# EAGLE design backplane (EAGLE 8.0.1)
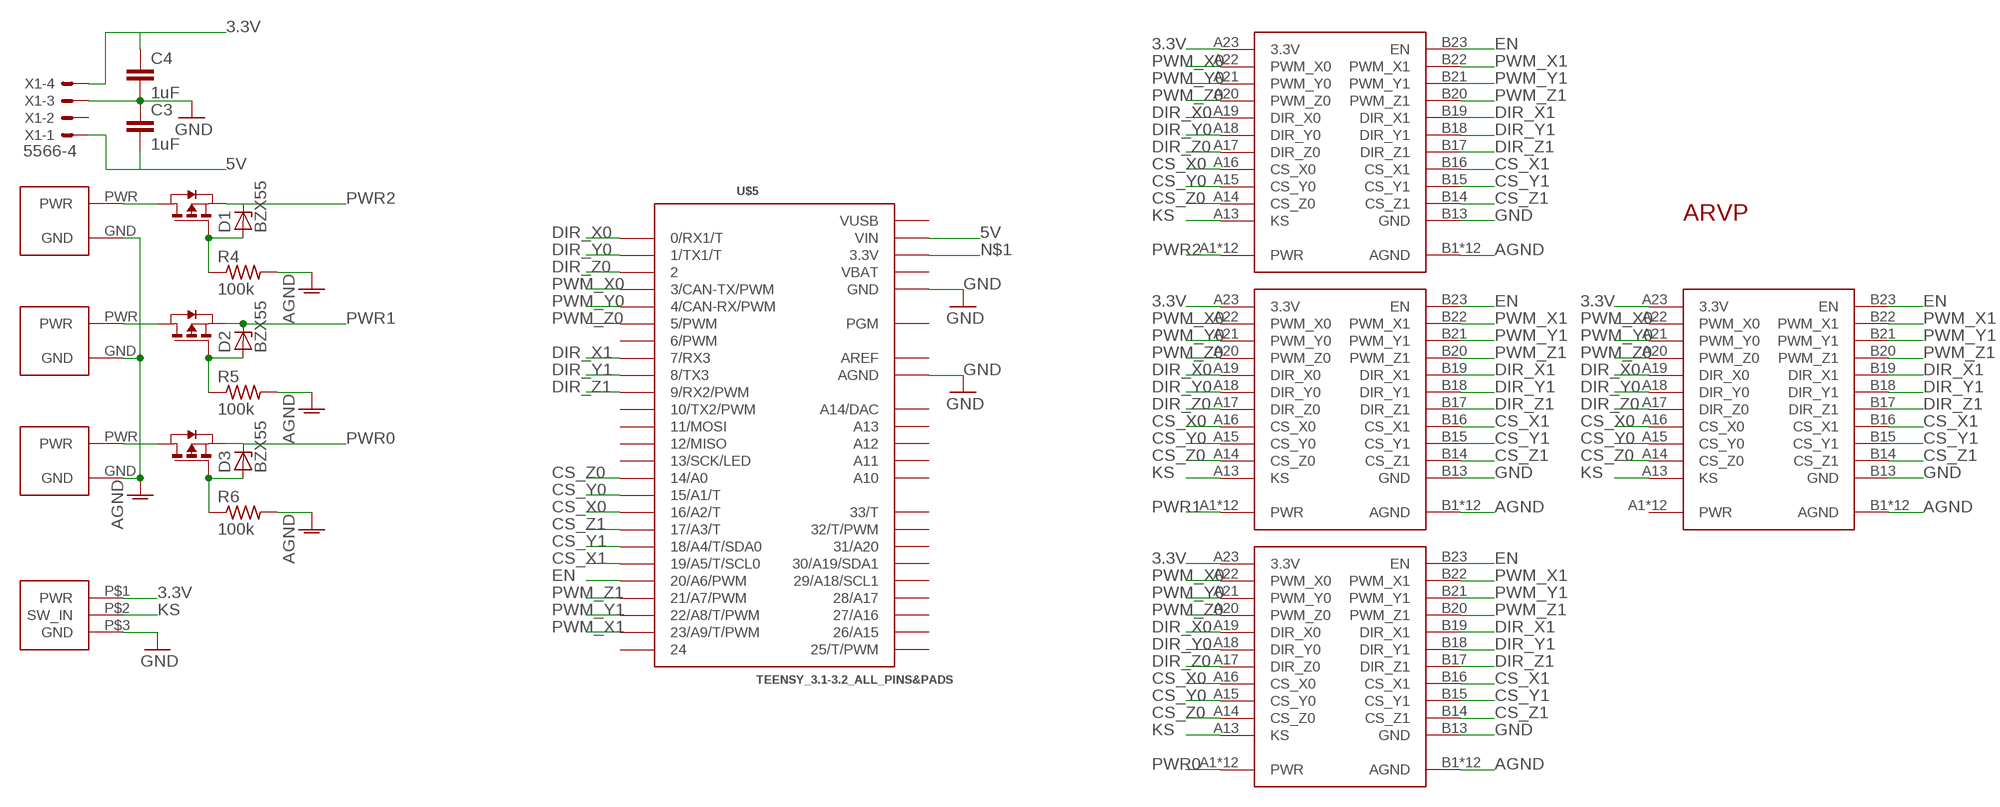
[diagram p0: schematic, sheet 1]

## Parts
C3  1uF  C5/2.5  [C5B2.5]
C4  1uF  C5/2.5  [C5B2.5]
D1  BZX55  [DO35Z10]
D2  BZX55  [DO35Z10]
D3  BZX55  [DO35Z10]
R4  100k  R-US_0309/12  [0309/12]
R5  100k  R-US_0309/12  [0309/12]
R6  100k  R-US_0309/12  [0309/12]
U$1  AND_PWR  [AND_PWR]
U$2  AND_PWR  [AND_PWR]
U$3  AND_PWR  [AND_PWR]
U$4  CONN_50PIN  [CONN_50PIN]
U$5  TEENSY_3.1-3.2_ALL_PINS&PADS  [TEENSY_3.0-3.2_ALL_PINS_&_PADS]
U$6  IPB180P04P4L-02  [PG-TO263-7-3]
U$7  IPB180P04P4L-02  [PG-TO263-7-3]
U$8  IPB180P04P4L-02  [PG-TO263-7-3]
U$9  CONN_50PIN  [CONN_50PIN]
U$10  CONN_50PIN  [CONN_50PIN]
U$11  CONN_50PIN  [CONN_50PIN]
U$12  KILL_SW  [KILL_SW]
U$13  ARVP_LOGO  [ARVP]
X1  5566-4  [5566-4]

## Nets
3.3V: C4.1 U$4.A23(3.3V) U$9.A23(3.3V) U$10.A23(3.3V) U$11.A23(3.3V) U$12.P$1(PWR) X1.4
5V: C3.2 U$5.VIN X1.1
AGND: R4.2 R5.2 R6.2 U$1.GND U$2.GND U$3.GND U$4.B1(AGND) U$4.B2(AGND) U$4.B3(AGND) U$4.B4(AGND) U$4.B5(AGND) U$4.B6(AGND) U$4.B7(AGND) U$4.B8(AGND) U$4.B9(AGND) U$4.B10(AGND) U$4.B11(AGND) U$4.B12(AGND) U$9.B1(AGND) U$9.B2(AGND) U$9.B3(AGND) U$9.B4(AGND) U$9.B5(AGND) U$9.B6(AGND) U$9.B7(AGND) U$9.B8(AGND) U$9.B9(AGND) U$9.B10(AGND) U$9.B11(AGND) U$9.B12(AGND) U$10.B1(AGND) U$10.B2(AGND) U$10.B3(AGND) U$10.B4(AGND) U$10.B5(AGND) U$10.B6(AGND) U$10.B7(AGND) U$10.B8(AGND) U$10.B9(AGND) U$10.B10(AGND) U$10.B11(AGND) U$10.B12(AGND) U$11.B1(AGND) U$11.B2(AGND) U$11.B3(AGND) U$11.B4(AGND) U$11.B5(AGND) U$11.B6(AGND) U$11.B7(AGND) U$11.B8(AGND) U$11.B9(AGND) U$11.B10(AGND) U$11.B11(AGND) U$11.B12(AGND)
BAT+0: U$3.PWR U$8.8(D)
BAT+1: U$2.PWR U$6.8(D)
BAT+2: U$1.PWR U$7.8(D)
CS_X0: U$4.A16(CS_X0) U$5.16/A2(16/A2/T) U$9.A16(CS_X0) U$10.A16(CS_X0) U$11.A16(CS_X0)
CS_X1: U$4.B16(CS_X1) U$5.19/A5(19/A5/T/SCL0) U$9.B16(CS_X1) U$10.B16(CS_X1) U$11.B16(CS_X1)
CS_Y0: U$4.A15(CS_Y0) U$5.15/A1(15/A1/T) U$9.A15(CS_Y0) U$10.A15(CS_Y0) U$11.A15(CS_Y0)
CS_Y1: U$4.B15(CS_Y1) U$5.18/A4(18/A4/T/SDA0) U$9.B15(CS_Y1) U$10.B15(CS_Y1) U$11.B15(CS_Y1)
CS_Z0: U$4.A14(CS_Z0) U$5.14/A0 U$9.A14(CS_Z0) U$10.A14(CS_Z0) U$11.A14(CS_Z0)
CS_Z1: U$4.B14(CS_Z1) U$5.17/A3(17/A3/T) U$9.B14(CS_Z1) U$10.B14(CS_Z1) U$11.B14(CS_Z1)
DIR_X0: U$4.A19(DIR_X0) U$5.0(0/RX1/T) U$9.A19(DIR_X0) U$10.A19(DIR_X0) U$11.A19(DIR_X0)
DIR_X1: U$4.B19(DIR_X1) U$5.7(7/RX3) U$9.B19(DIR_X1) U$10.B19(DIR_X1) U$11.B19(DIR_X1)
DIR_Y0: U$4.A18(DIR_Y0) U$5.1(1/TX1/T) U$9.A18(DIR_Y0) U$10.A18(DIR_Y0) U$11.A18(DIR_Y0)
DIR_Y1: U$4.B18(DIR_Y1) U$5.8(8/TX3) U$9.B18(DIR_Y1) U$10.B18(DIR_Y1) U$11.B18(DIR_Y1)
DIR_Z0: U$4.A17(DIR_Z0) U$5.2 U$9.A17(DIR_Z0) U$10.A17(DIR_Z0) U$11.A17(DIR_Z0)
DIR_Z1: U$4.B17(DIR_Z1) U$5.9(9/RX2/PWM) U$9.B17(DIR_Z1) U$10.B17(DIR_Z1) U$11.B17(DIR_Z1)
EN: U$4.B23(EN) U$5.20/A6(20/A6/PWM) U$9.B23(EN) U$10.B23(EN) U$11.B23(EN)
GND: C3.1 C4.2 U$4.B13(GND) U$5.AGND U$5.GND U$5.GND1(GND) U$5.GND2(GND) U$9.B13(GND) U$10.B13(GND) U$11.B13(GND) U$12.P$3(GND) X1.3
KS: U$4.A13(KS) U$9.A13(KS) U$10.A13(KS) U$11.A13(KS) U$12.P$2(SW_IN)
N$1: U$5.3.3V U$5.3.3V1(3.3V) U$5.3.3V2(3.3V)
N$5: D3.A R6.1 U$8.1(G)
N$6: D2.A R5.1 U$6.1(G)
N$7: D1.A R4.1 U$7.1(G)
PWM_X0: U$4.A22(PWM_X0) U$5.3(3/CAN-TX/PWM) U$9.A22(PWM_X0) U$10.A22(PWM_X0) U$11.A22(PWM_X0)
PWM_X1: U$4.B22(PWM_X1) U$5.23/A9(23/A9/T/PWM) U$9.B22(PWM_X1) U$10.B22(PWM_X1) U$11.B22(PWM_X1)
PWM_Y0: U$4.A21(PWM_Y0) U$5.4(4/CAN-RX/PWM) U$9.A21(PWM_Y0) U$10.A21(PWM_Y0) U$11.A21(PWM_Y0)
PWM_Y1: U$4.B21(PWM_Y1) U$5.22/A8(22/A8/T/PWM) U$9.B21(PWM_Y1) U$10.B21(PWM_Y1) U$11.B21(PWM_Y1)
PWM_Z0: U$4.A20(PWM_Z0) U$5.5(5/PWM) U$9.A20(PWM_Z0) U$10.A20(PWM_Z0) U$11.A20(PWM_Z0)
PWM_Z1: U$4.B20(PWM_Z1) U$5.21/A7(21/A7/PWM) U$9.B20(PWM_Z1) U$10.B20(PWM_Z1) U$11.B20(PWM_Z1)
PWR0: D3.C U$4.A1(PWR) U$4.A2(PWR) U$4.A3(PWR) U$4.A4(PWR) U$4.A5(PWR) U$4.A6(PWR) U$4.A7(PWR) U$4.A8(PWR) U$4.A9(PWR) U$4.A10(PWR) U$4.A11(PWR) U$4.A12(PWR) U$8.2(S) U$8.3(S) U$8.5(S) U$8.6(S) U$8.7(S)
PWR1: D2.C U$6.2(S) U$6.3(S) U$6.5(S) U$6.6(S) U$6.7(S) U$9.A1(PWR) U$9.A2(PWR) U$9.A3(PWR) U$9.A4(PWR) U$9.A5(PWR) U$9.A6(PWR) U$9.A7(PWR) U$9.A8(PWR) U$9.A9(PWR) U$9.A10(PWR) U$9.A11(PWR) U$9.A12(PWR)
PWR2: D1.C U$7.2(S) U$7.3(S) U$7.5(S) U$7.6(S) U$7.7(S) U$10.A1(PWR) U$10.A2(PWR) U$10.A3(PWR) U$10.A4(PWR) U$10.A5(PWR) U$10.A6(PWR) U$10.A7(PWR) U$10.A8(PWR) U$10.A9(PWR) U$10.A10(PWR) U$10.A11(PWR) U$10.A12(PWR)
Unconnected: U$5.6(6/PWM) U$5.10(10/TX2/PWM) U$5.11(11/MOSI) U$5.12(12/MISO) U$5.13(13/SCK/LED) U$5.24 U$5.25(25/T/PWM) U$5.26(26/A15) U$5.27(27/A16) U$5.28(28/A17) U$5.29(29/A18/SCL1) U$5.30(30/A19/SDA1) U$5.31(31/A20) U$5.32(32/T/PWM) U$5.33(33/T) U$5.A10 U$5.A11 U$5.A12 U$5.A13 U$5.PGM U$5.RESET/DAC(A14/DAC) U$11.A1(PWR) U$11.A2(PWR) U$11.A3(PWR) U$11.A4(PWR) U$11.A5(PWR) U$11.A6(PWR) U$11.A7(PWR) U$11.A8(PWR) U$11.A9(PWR) U$11.A10(PWR) U$11.A11(PWR) U$11.A12(PWR) X1.2

## Power pins joined to a net without a drawn wire
AREF: U$5.AREF
VBAT: U$5.VBAT
VUSB: U$5.VUSB

## Library data of the parts
C3 C4 = capacitor-wima:C: CAPACITOR naming: grid - package width
D1-D3 = diode:BZX55: Z DIODE
R4-R6 = rcl:R-US_: RESISTOR, American symbol
U$1-U$3 = motor:AND_PWR
U$4 U$9-U$11 = motor:CONN_50PIN
U$5 = motor:TEENSY_3.1-3.2_ALL_PINS&PADS: Footprint for Teensy 3.1 or 3.2 board using all pads and all through-holes. Pads need a 2x7 0.1" SMD header.
U$6-U$8 = motor:IPB180P04P4L-02
U$12 = motor:KILL_SW
U$13 = motor:ARVP_LOGO
X1 = motor:5566-4: Mini FIT connector 4 pol Source: http://www.molex.com; OC_FARNELL: unknown; OC_NEWARK: unknown

## Board
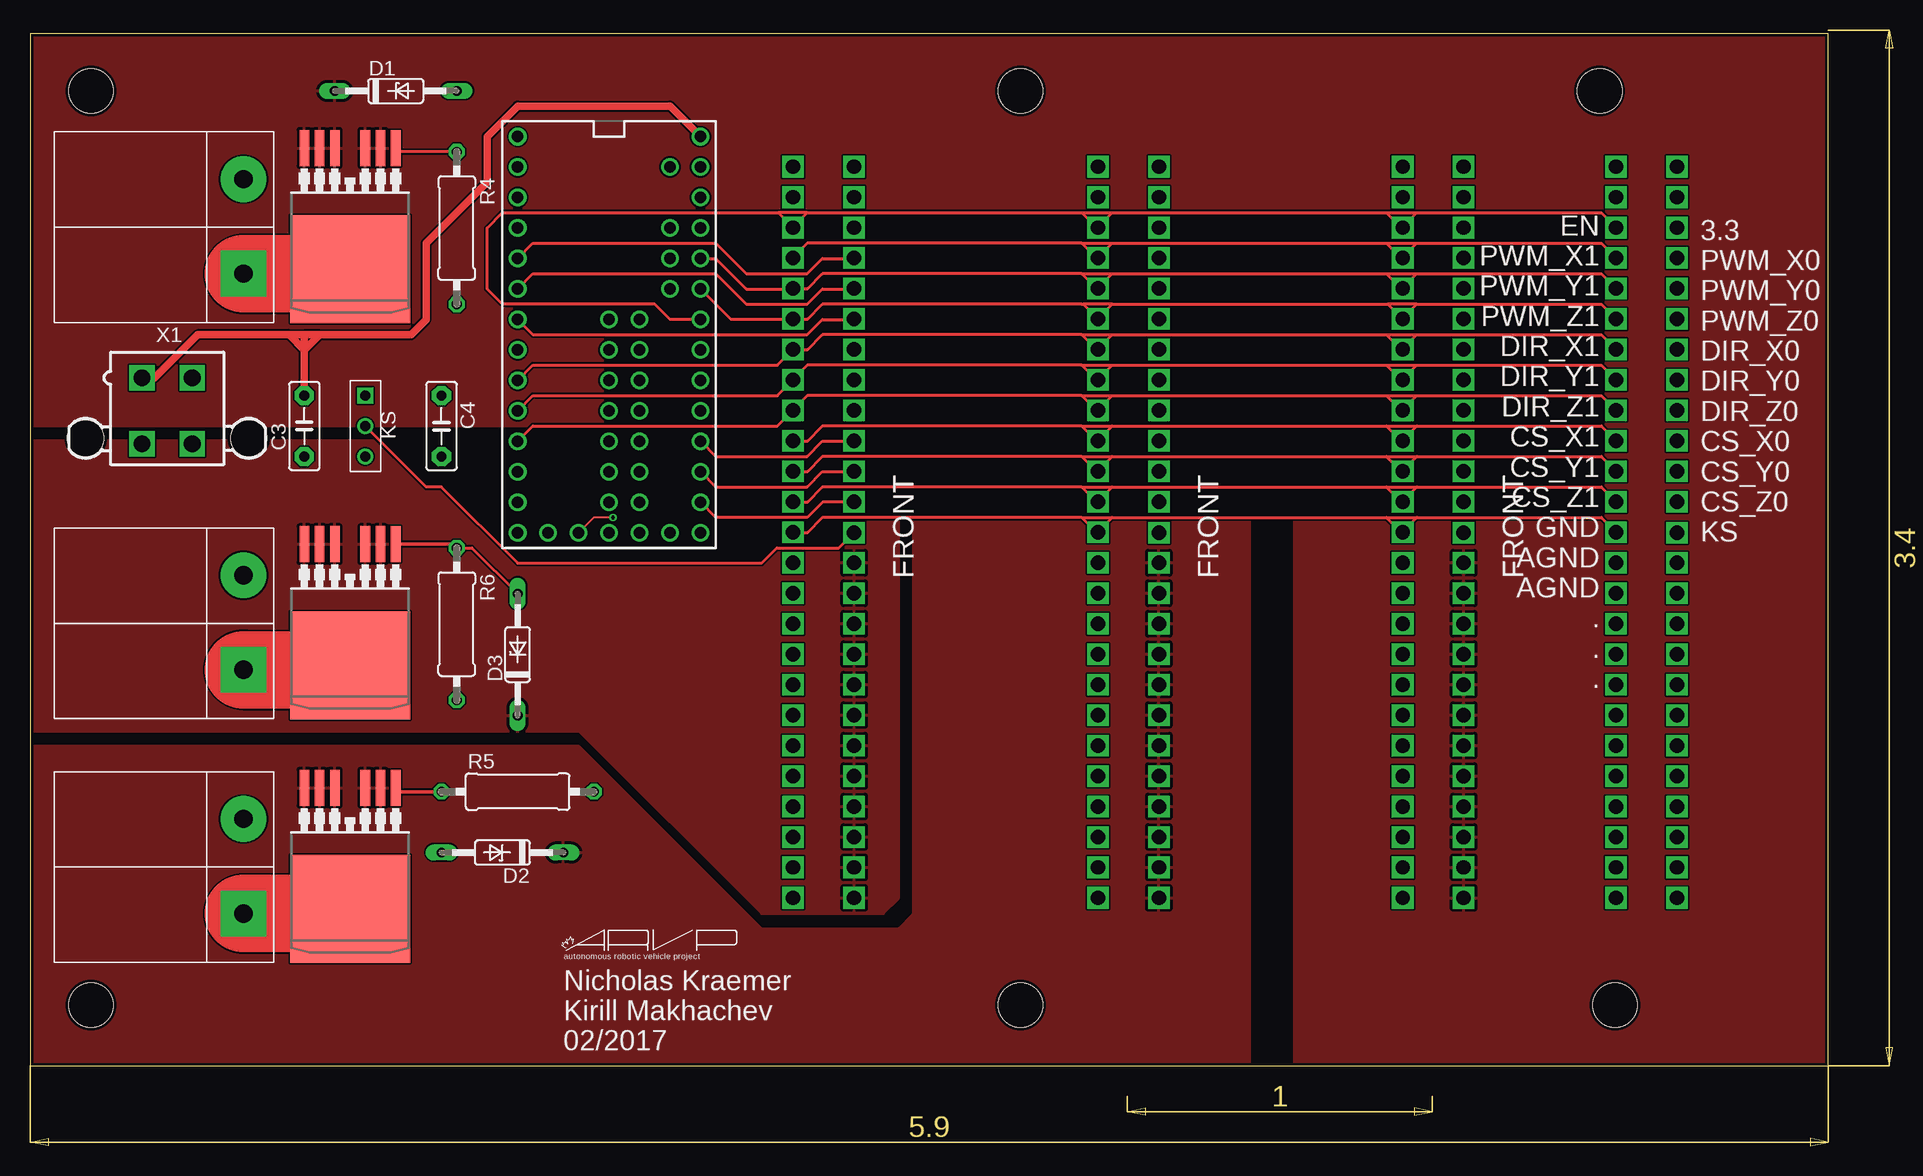
[diagram p1: board, top side]
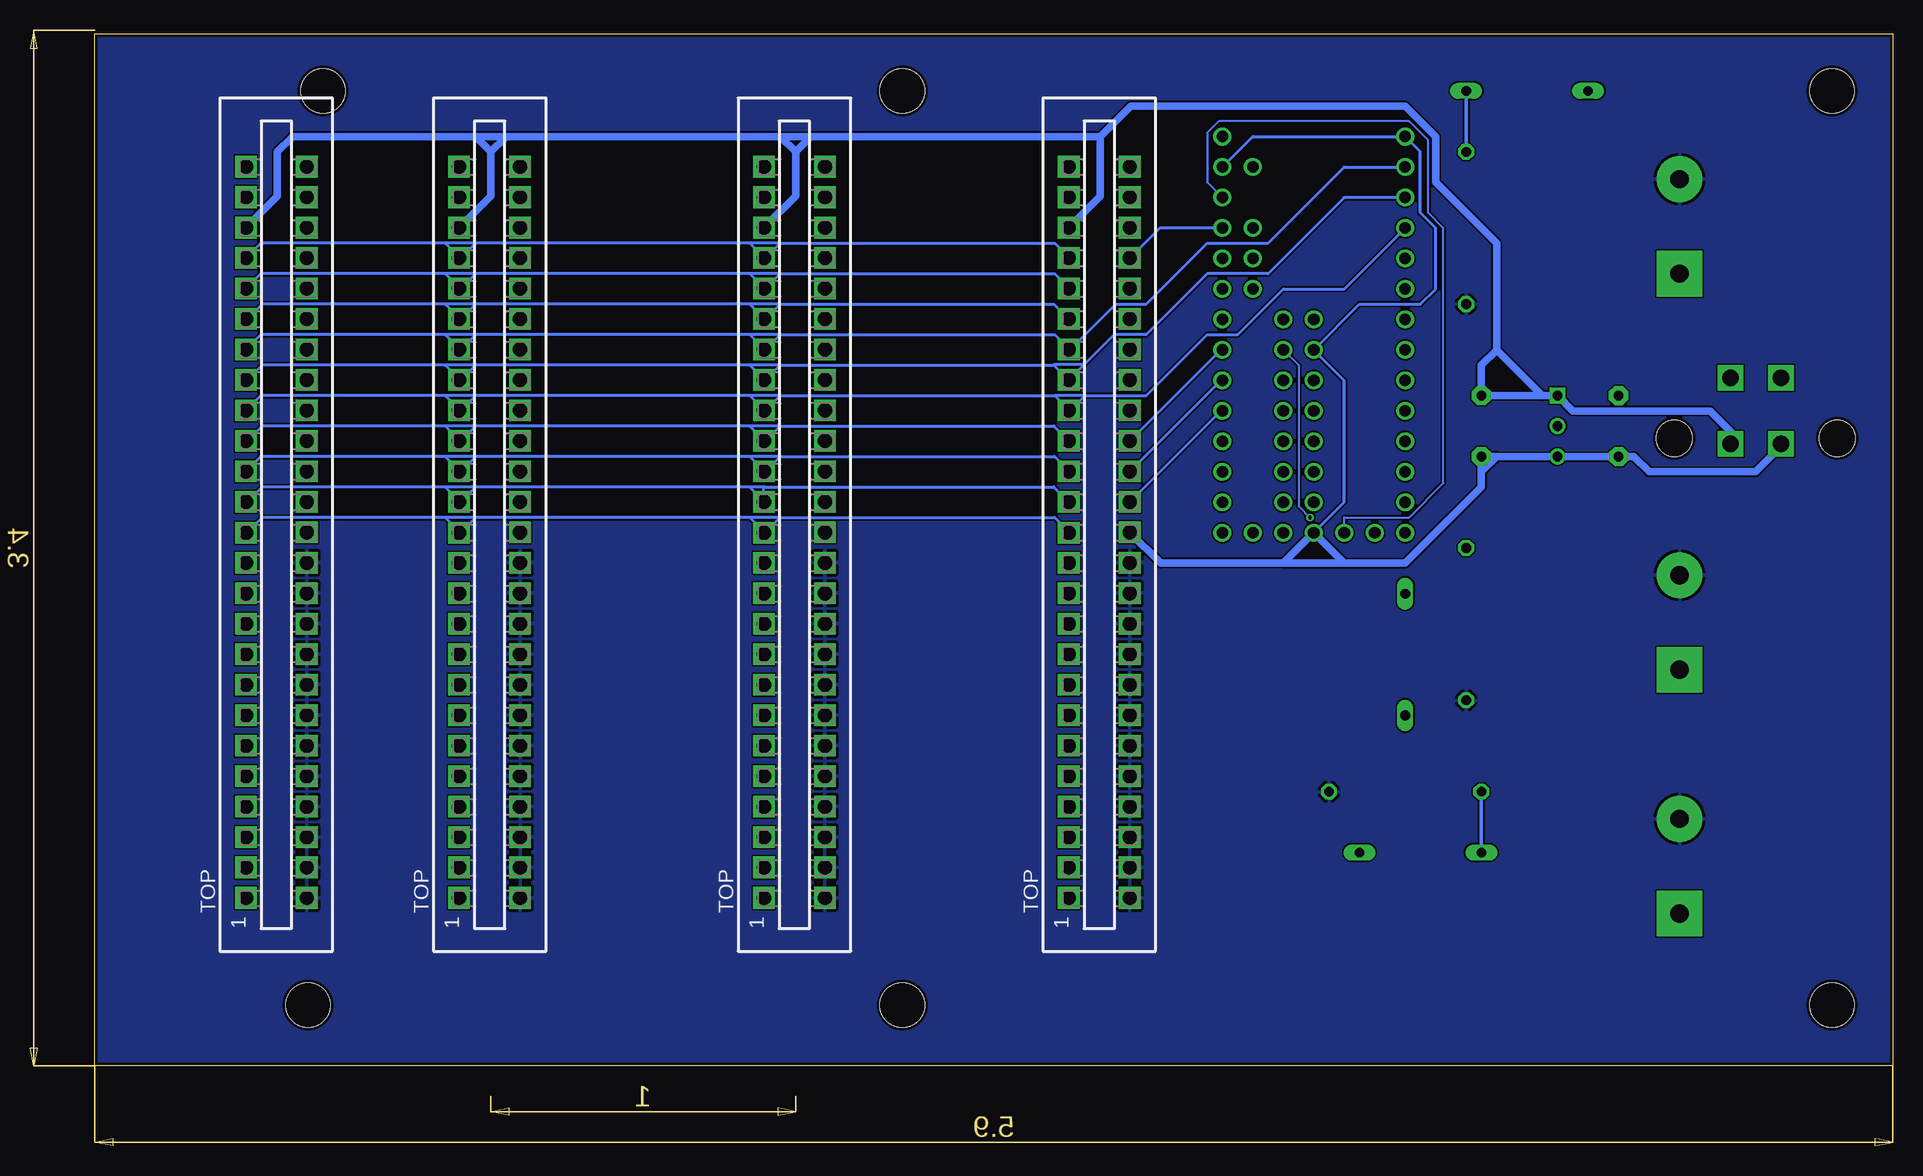
[diagram p2: board, bottom side, seen from below]

Size 149.84 x 86.03 mm. Coordinates in mm from the lower left corner, seen from the top.
Outline: 0,0 149.84,0 149.84,86.03 0,86.03 0,0
Copper layers (1*16): Top 0.035mm / dielectric 1.5mm / Bottom 0.035mm
Design rules "ITEADstudioDRC": minimum track width 6mil, minimum drill 12mil, track to track 6mil, track to pad 6mil, pad to pad 6mil, via to via 6mil, smd to smd 0mil, copper to edge 10mil, drill to drill 10mil, minimum pad ring 10mil, minimum via ring 6mil, stop-mask expansion 2mil, vias tented up to drill 100mil, thermal gap 10mil
Holes 3.7 mm at 5.08,5.08 82.55,5.08 82.55,81.28 130.81,81.28 5.08,81.28 132.08,5.08

### Footprints (pad centres in the part's own frame; a part is rotated, then mirrored left to right if it is on the bottom)
C5B2.5 = drill 0.813 pad 1.6 octagon: 1 -2.54,0; 2 2.54,0
DO35Z10 = drill 0.813 long: A 5.08,0; C -5.08,0
0309/12 = drill 0.813 octagon: 1 -6.35,0; 2 6.35,0
AND_PWR = drill 1.524 pad 3.81: GND 0,-7.886 | drill 1.524 pad 3.81 square: PWR 0,0
CONN_50PIN = drill 1.2 pad 1.778 square: A1 -30.446,-2.446; A2 -27.906,-2.446; A3 -25.366,-2.446; A4 -22.826,-2.446; A5 -20.286,-2.446; A6 -17.746,-2.446; A7 -15.206,-2.446; A8 -12.666,-2.446; A9 -10.126,-2.446; A10 -7.586,-2.446; A11 -5.046,-2.446; A12 -2.506,-2.446; A13 0,-2.446; A14 2.574,-2.446; A15 5.114,-2.446; A16 7.654,-2.446; A17 10.194,-2.446; A18 12.734,-2.446; A19 15.274,-2.446; A20 17.814,-2.446; A21 20.354,-2.446; A22 22.894,-2.446; A23 25.434,-2.446; A24 27.974,-2.446; A25 30.514,-2.446; B1 -30.446,-7.526; B2 -27.906,-7.526; B3 -25.366,-7.526; B4 -22.826,-7.526; B5 -20.286,-7.526; B6 -17.746,-7.526; B7 -15.206,-7.526; B8 -12.666,-7.526; B9 -10.126,-7.526; B10 -7.586,-7.526; B11 -5.046,-7.526; B12 -2.506,-7.526; B13 0.034,-7.526; B14 2.574,-7.526; B15 5.114,-7.526; B16 7.654,-7.526; B17 10.194,-7.526; B18 12.734,-7.526; B19 15.274,-7.526; B20 17.814,-7.526; B21 20.354,-7.526; B22 22.894,-7.526; B23 25.434,-7.526; B24 27.974,-7.526; B25 30.514,-7.526
TEENSY_3.0-3.2_ALL_PINS_&_PADS = drill 0.965: 0 -7.62,13.97; 1 -7.62,11.43; 2 -7.62,8.89; 3 -7.62,6.35; 3.3V 7.62,11.43; 3.3V1 -2.54,-16.51; 3.3V2 2.54,-1.27; 4 -7.62,3.81; 5 -7.62,1.27; 6 -7.62,-1.27; 7 -7.62,-3.81; 8 -7.62,-6.35; 9 -7.62,-8.89; 10 -7.62,-11.43; 11 -7.62,-13.97; 12 -7.62,-16.51; 13 7.62,-16.51; 14/A0 7.62,-13.97; 15/A1 7.62,-11.43; 16/A2 7.62,-8.89; 17/A3 7.62,-6.35; 18/A4 7.62,-3.81; 19/A5 7.62,-1.27; 20/A6 7.62,1.27; 21/A7 7.62,3.81; 22/A8 7.62,6.35; 23/A9 7.62,8.89; 24 0,-3.81; 25 0,-6.35; 26 0,-8.89; 27 0,-11.43; 28 0,-13.97; 29 2.54,-13.97; 30 2.54,-11.43; 31 2.54,-8.89; 32 2.54,-6.35; 33 2.54,-3.81; A10 5.08,6.35; A11 5.08,3.81; A12 0,1.27; A13 2.54,1.27; AGND 7.62,13.97; AREF 5.08,8.89; GND -7.62,16.51; GND1 0,-16.51; GND2 0,-1.27; PGM 2.54,-16.51; RESET/DAC 5.08,-16.51; VBAT -5.08,-16.51; VIN 7.62,16.51; VUSB 5.08,13.97
PG-TO263-7-3 = smd 0.8 x 3: 1 -3.81,-9.207; 2 -2.54,-9.207; 3 -1.27,-9.207; 5 1.27,-9.207; 6 2.54,-9.207; 7 3.81,-9.207 | smd 10 x 9: 8 0,0.895
KILL_SW = drill 0.8 square: P$1 -1.27,0 | drill 0.8: P$2 1.27,0; P$3 3.81,0
5566-4 = drill 1.4 square: 1 2.1,-2.75; 2 -2.1,-2.75; 3 2.1,2.75; 4 -2.1,2.75 | hole 3: 6.8,2.29; -6.8,2.29

### Placement (x,y rotation side)
C3  22.86,53.34 90 top
C4  34.29,53.34 270 top
D1  30.48,81.28 0 top
D2  39.37,17.78 180 top
D3  40.64,34.29 90 top
R4  35.56,69.85 270 top
R5  40.64,22.86 0 top
R6  35.56,36.83 270 top
U$1  17.78,66.04 180 top
U$2  17.78,12.7 180 top
U$3  17.78,33.02 180 top
U$4  71.12,44.45 90 bottom
U$5  48.26,60.96 0 top
U$6  26.67,13.97 180 top
U$7  26.67,67.31 180 top
U$8  26.67,34.29 180 top
U$9  96.52,44.45 90 bottom
U$10  121.92,44.45 90 bottom
U$11  139.7,44.45 90 bottom
U$12  27.94,54.61 270 top
U$13  44.45,8.89 0 top
X1  11.43,54.61 180 top

### Tracks (layer width: path | path; a pad name or v marks a point on that pad's centre or on a via)
3.3V
  Bottom 0.61: 33.02,59.69 33.02,68.58 38.1,73.66 38.1,77.47 40.64,80.01 63.5,80.01 66.04,77.47 | 66.04,77.47 66.04,72.52 U$4.A23 | X1.4 13.53,52.9 15.24,54.61 26.67,54.61 U$12.P$1 29.21,55.88 | 66.04,77.47 90.17,77.47 | 90.17,77.47 91.44,76.2 | 91.44,76.2 91.44,72.52 U$9.A23 | 92.71,77.47 90.17,77.47 | 92.71,77.47 115.57,77.47 | 115.57,77.47 116.84,76.2 | 116.84,76.2 116.84,72.52 U$10.A23 | 115.57,77.47 118.11,77.47 | 116.84,76.2 118.11,77.47 | 91.44,76.2 92.71,77.47 | 118.11,77.47 133.35,77.47 134.62,76.2 134.62,72.52 U$11.A23 | 29.21,55.88 C4.1 34.29,58.42 33.02,59.69 | 29.21,55.88 33.02,59.69
5V
  Top 0.61: X1.1 10.37,57.36 13.97,60.96 21.59,60.96 | 21.59,60.96 22.86,60.96 | 24.13,60.96 22.86,60.96 | 24.13,60.96 31.75,60.96 33.02,62.23 33.02,68.58 38.1,73.66 38.1,77.47 40.64,80.01 53.34,80.01 U$5.VIN | C3.2 22.86,59.69 | 22.86,59.69 22.86,60.96 | 22.86,59.69 24.13,60.96 | 22.86,59.69 21.59,60.96
AGND
  pour Bottom: -1.27,87.63 151.13,87.63 151.13,-1.27 -1.27,-1.27
BAT+0
  Top 6.452: U$3.PWR 26.3,33.02 U$8.8
BAT+1
  Top 6.452: U$2.PWR 27.05,12.7 | 27.94,12.7 27.05,12.7 | 27.05,12.7 U$6.8
BAT+2
  Top 6.452: U$1.PWR 26.3,66.04 U$7.8
CS_X0
  Top 0.254: U$5.16/A2 57.15,50.8 64.77,50.8 66.04,52.07 68.64,52.07 U$4.A16
  Bottom 0.254: U$11.A16 137.13,52.1 135.89,53.34 120.65,53.34 | 118.11,53.34 120.65,53.34 | 95.25,53.34 118.11,53.34 | 92.71,53.34 95.25,53.34 | 92.71,53.34 69.91,53.34 U$4.A16 | 120.65,53.34 119.47,52.16 U$10.A16 119.35,52.1 118.11,53.34 | 95.25,53.34 94.07,52.16 U$9.A16 93.95,52.1 92.71,53.34
CS_X1
  Top 0.254: U$4.B16 64.8,52.1 66.04,53.34 87.63,53.34 | U$11.B16 130.94,53.34 115.57,53.34 | 113.03,53.34 115.57,53.34 | 90.17,53.34 113.03,53.34 | 87.63,53.34 90.17,53.34 | 115.57,53.34 114.39,52.16 U$10.B16 114.27,52.1 113.03,53.34 | 90.17,53.34 88.99,52.16 U$9.B16 88.87,52.1 87.63,53.34
  Bottom 0.254: U$5.19/A5 56.01,59.69 U$4.B16
CS_Y0
  Top 0.254: U$5.15/A1 57.15,48.26 64.77,48.26 66.04,49.53 68.64,49.53 U$4.A15
  Bottom 0.254: U$4.A15 68.67,49.62 69.85,50.8 92.71,50.8 | 118.11,50.8 120.65,50.8 | 95.25,50.8 118.11,50.8 | 92.71,50.8 95.25,50.8 | 120.65,50.8 136.02,50.8 U$11.A15 | 120.65,50.8 119.47,49.62 U$10.A15 119.35,49.56 118.11,50.8 | 95.25,50.8 94.07,49.62 U$9.A15 93.95,49.56 92.71,50.8
CS_Y1
  Top 0.254: U$4.B15 64.8,49.56 66.04,50.8 87.63,50.8 | 113.03,50.8 115.57,50.8 | 90.17,50.8 113.03,50.8 | 87.63,50.8 90.17,50.8 | 115.57,50.8 130.94,50.8 U$11.B15 | 115.57,50.8 114.39,49.62 U$10.B15 114.27,49.56 113.03,50.8 | 90.17,50.8 88.99,49.62 U$9.B15 88.87,49.56 87.63,50.8
  Bottom 0.254: U$5.18/A4 56.01,57.15 U$4.B15
CS_Z0
  Top 0.254: U$5.14/A0 57.15,45.72 64.77,45.72 66.07,47.02 U$4.A14
  Bottom 0.254: U$11.A14 137.13,47.02 135.89,48.26 120.65,48.26 | 118.11,48.26 120.65,48.26 | 95.25,48.26 118.11,48.26 | 93.98,48.26 95.25,48.26 | 93.98,48.26 69.91,48.26 U$4.A14 | 120.65,48.26 119.47,47.08 U$10.A14 119.35,47.02 118.11,48.26 | 95.25,48.26 94.07,47.08 U$9.A14 94.07,48.17 93.98,48.26
CS_Z1
  Top 0.254: U$4.B14 64.8,47.02 66.04,48.26 87.63,48.26 | 113.03,48.26 115.57,48.26 | 90.17,48.26 113.03,48.26 | 87.63,48.26 90.17,48.26 | 115.57,48.26 130.94,48.26 U$11.B14 | 115.57,48.26 114.39,47.08 U$10.B14 114.27,47.02 113.03,48.26 | 90.17,48.26 88.99,47.08 U$9.B14 88.87,47.02 87.63,48.26
  Bottom 0.254: U$5.17/A3 56.01,54.61 U$4.B14
DIR_X0
  Bottom 0.254: U$5.0 45.72,74.93 52.07,68.58 57.15,68.58 62.23,63.5 64.77,63.5 68.55,59.72 U$4.A19 68.67,59.78 69.85,60.96 92.71,60.96 | 118.11,60.96 120.65,60.96 | 95.25,60.96 118.11,60.96 | 92.71,60.96 95.25,60.96 | 120.65,60.96 136.02,60.96 U$11.A19 | 120.65,60.96 119.47,59.78 U$10.A19 119.35,59.72 118.11,60.96 | 95.25,60.96 94.07,59.78 U$9.A19 93.95,59.72 92.71,60.96
DIR_X1
  Top 0.254: U$5.7 41.91,58.42 62.29,58.42 U$4.B19 64.8,59.72 66.04,60.96 87.63,60.96 | U$11.B19 130.94,60.96 115.57,60.96 | 113.03,60.96 115.57,60.96 | 90.17,60.96 113.03,60.96 | 87.63,60.96 90.17,60.96 | 115.57,60.96 114.39,59.78 U$10.B19 114.27,59.72 113.03,60.96 | 90.17,60.96 88.99,59.78 U$9.B19 88.87,59.72 87.63,60.96
DIR_Y0
  Bottom 0.254: U$5.1 45.72,72.39 52.07,66.04 57.15,66.04 62.23,60.96 64.9,60.96 67.37,58.48 | 67.37,58.48 U$4.A18 69.91,58.42 | U$11.A18 137.13,57.18 135.89,58.42 120.65,58.42 | 118.11,58.42 120.65,58.42 | 95.25,58.42 118.11,58.42 | 92.71,58.42 95.25,58.42 | 92.71,58.42 69.91,58.42 | 67.37,58.48 69.85,58.48 69.91,58.42 | 120.65,58.42 119.47,57.24 U$10.A18 119.35,57.18 118.11,58.42 | 95.25,58.42 94.07,57.24 U$9.A18 93.95,57.18 92.71,58.42
DIR_Y1
  Top 0.254: U$5.8 41.91,55.88 62.29,55.88 U$4.B18 63.59,57.24 64.77,58.42 87.63,58.42 | U$11.B18 130.94,58.42 115.57,58.42 | 113.03,58.42 115.57,58.42 | 90.17,58.42 113.03,58.42 | 87.63,58.42 90.17,58.42 | 115.57,58.42 114.39,57.24 U$10.B18 114.27,57.18 113.03,58.42 | 90.17,58.42 88.99,57.24 U$9.B18 88.87,57.18 87.63,58.42
DIR_Z0
  Bottom 0.254: 67.31,55.88 68.55,54.64 U$4.A17 68.67,54.7 69.85,55.88 | 67.31,55.88 62.23,55.88 57.15,60.96 54.61,60.96 50.8,64.77 45.72,64.77 U$5.2 | 118.11,55.88 120.65,55.88 | 95.25,55.88 118.11,55.88 | 92.71,55.88 95.25,55.88 | 92.71,55.88 69.85,55.88 | 120.65,55.88 136.02,55.88 U$11.A17 | 67.31,55.88 69.85,55.88 | 120.65,55.88 119.47,54.7 U$10.A17 119.35,54.64 118.11,55.88 | 95.25,55.88 94.07,54.7 U$9.A17 93.95,54.64 92.71,55.88
DIR_Z1
  Top 0.254: U$5.9 41.91,53.34 62.29,53.34 U$4.B17 63.59,54.7 64.77,55.88 87.63,55.88 | U$11.B17 130.94,55.88 115.57,55.88 | 113.03,55.88 115.57,55.88 | 90.17,55.88 113.03,55.88 | 87.63,55.88 90.17,55.88 | 115.57,55.88 114.39,54.7 U$10.B17 114.27,54.64 113.03,55.88 | 90.17,55.88 88.99,54.7 U$9.B17 88.87,54.64 87.63,55.88
EN
  Top 0.254: U$5.20/A6 53.34,62.23 52.07,63.5 39.37,63.5 38.1,64.77 38.1,69.85 39.37,71.12 62.36,71.12 | 62.36,71.12 U$4.B23 63.59,69.94 64.77,71.12 | 113.03,71.12 115.57,71.12 | 90.17,71.12 113.03,71.12 | 87.63,71.12 90.17,71.12 | 64.77,71.12 87.63,71.12 | 64.77,71.12 62.36,71.12 | 115.57,71.12 130.94,71.12 U$11.B23 | 115.57,71.12 114.39,69.94 U$10.B23 114.27,69.88 113.03,71.12 | 90.17,71.12 88.99,69.94 U$9.B23 88.87,69.88 87.63,71.12
GND
  Top 0.254: U$4.B13 64.8,44.48 66.04,45.72 87.63,45.72 | U$11.B13 130.94,45.72 115.57,45.72 | 113.03,45.72 115.57,45.72 | 90.17,45.72 113.03,45.72 | 87.63,45.72 90.17,45.72 | 115.57,45.72 114.39,44.54 U$10.B13 114.27,44.48 113.03,45.72 | 90.17,45.72 88.99,44.54 U$9.B13 88.87,44.48 87.63,45.72
  Bottom 0.254: U$5.AGND 53.34,77.47 U$5.GND 39.37,76.2 39.37,71.12 38.1,69.85 38.1,64.77 39.37,63.5 44.45,63.5 U$5.GND2 45.72,57.15 45.72,46.99 U$5.GND1
  Bottom 0.61: 45.72,41.91 40.64,41.91 34.29,48.26 34.29,49.53 | 50.8,41.91 45.72,41.91 | 50.8,41.91 61.02,41.91 U$4.B13 | 45.72,41.91 U$5.GND1 50.8,41.91 | X1.3 9.33,51.63 11.43,49.53 20.32,49.53 21.59,50.8 C3.1 U$12.P$3 33.02,50.8 | 33.02,50.8 C4.2 34.29,49.53 | 34.29,49.53 33.02,50.8
KS
  Top 0.254: U$4.A13 67.4,43.18 62.23,43.18 60.96,41.91 40.64,41.91 34.29,48.26 33.02,48.26 U$12.P$2
  Bottom 0.254: U$11.A13 137.16,44.45 135.89,45.72 120.65,45.72 | U$4.A13 68.67,44.54 69.85,45.72 92.71,45.72 | 118.11,45.72 120.65,45.72 | 95.25,45.72 118.11,45.72 | 92.71,45.72 95.25,45.72 | 120.65,45.72 119.47,44.54 U$10.A13 119.38,44.45 118.11,45.72 | 95.25,45.72 94.07,44.54 U$9.A13 93.98,44.45 92.71,45.72
N$1  (via drill 0.3)
  Top 0.152: U$5.3.3V1 46.99,45.72 v48.58,45.72
  Bottom 0.152: v48.58,45.72 49.53,46.67 49.53,58.42 U$5.3.3V2 | U$5.3.3V 57.15,73.66 57.15,77.79 56.2,78.74 40.32,78.74 38.73,77.15 38.73,71.12 37.47,69.85 37.47,48.58 40.32,45.72 45.72,45.72 U$5.3.3V1
N$5
  Top 0.254: R6.1 36.83,43.18 D3.A
  Top 0.305: R6.1 35.56,43.5 U$8.1
N$6
  Top 0.305: R5.1 30.8,22.86 U$6.1
  Bottom 0.305: D2.A R5.1
N$7
  Top 0.254: R4.1 30.8,76.2 U$7.1
  Bottom 0.305: D1.A R4.1
PWM_X0
  Top 0.254: U$5.3 41.91,68.58 57.15,68.58 59.69,66.04 64.77,66.04 66.04,67.31 68.64,67.31 U$4.A22
  Bottom 0.254: U$4.A22 68.67,67.4 69.85,68.58 92.71,68.58 | 118.11,68.58 120.65,68.58 | 95.25,68.58 118.11,68.58 | 92.71,68.58 95.25,68.58 | 120.65,68.58 136.02,68.58 U$11.A22 | 120.65,68.58 119.47,67.4 U$10.A22 119.35,67.34 118.11,68.58 | 95.25,68.58 94.07,67.4 U$9.A22 93.95,67.34 92.71,68.58
PWM_X1
  Top 0.254: U$4.B22 63.59,67.4 64.77,68.58 87.63,68.58 | U$11.B22 130.94,68.58 115.57,68.58 | 113.03,68.58 115.57,68.58 | 90.17,68.58 113.03,68.58 | 87.63,68.58 90.17,68.58 | 115.57,68.58 114.39,67.4 U$10.B22 114.27,67.34 113.03,68.58 | 90.17,68.58 88.99,67.4 U$9.B22 88.87,67.34 87.63,68.58
  Bottom 0.254: U$5.23/A9 61.09,69.85 U$4.B22
PWM_Y0
  Top 0.254: U$5.4 41.91,66.04 57.15,66.04 59.69,63.5 64.77,63.5 66.04,64.77 68.64,64.77 U$4.A21
  Bottom 0.254: U$4.A21 68.67,64.86 69.85,66.04 92.71,66.04 | 118.11,66.04 120.65,66.04 | 95.25,66.04 118.11,66.04 | 92.71,66.04 95.25,66.04 | 120.65,66.04 136.02,66.04 U$11.A21 | 120.65,66.04 119.47,64.86 U$10.A21 119.35,64.8 118.11,66.04 | 95.25,66.04 94.07,64.86 U$9.A21 93.95,64.8 92.71,66.04
PWM_Y1
  Top 0.254: U$5.22/A8 57.15,67.31 59.69,64.77 63.56,64.77 U$4.B21 64.8,64.8 66.04,66.04 87.63,66.04 | U$11.B21 130.94,66.04 115.57,66.04 | 113.03,66.04 115.57,66.04 | 90.17,66.04 113.03,66.04 | 87.63,66.04 90.17,66.04 | 115.57,66.04 114.39,64.86 U$10.B21 114.27,64.8 113.03,66.04 | 90.17,66.04 88.99,64.86 U$9.B21 88.87,64.8 87.63,66.04
PWM_Z0
  Top 0.254: U$5.5 41.91,60.96 64.77,60.96 66.04,62.23 68.64,62.23 U$4.A20
  Bottom 0.254: U$11.A20 137.13,62.26 135.89,63.5 120.65,63.5 | 118.11,63.5 120.65,63.5 | 95.25,63.5 118.11,63.5 | 92.71,63.5 95.25,63.5 | 92.71,63.5 69.91,63.5 U$4.A20 | 120.65,63.5 119.47,62.32 U$10.A20 119.35,62.26 118.11,63.5 | 95.25,63.5 94.07,62.32 U$9.A20 93.95,62.26 92.71,63.5
PWM_Z1
  Top 0.254: U$5.21/A7 58.39,62.26 U$4.B20 64.8,62.26 66.04,63.5 87.63,63.5 87.76,63.5 | 87.76,63.5 U$9.B20 88.99,62.32 90.17,63.5 | 90.17,63.5 87.76,63.5 | 90.17,63.5 113.03,63.5 113.16,63.5 | 113.16,63.5 U$10.B20 114.39,62.32 115.57,63.5 | 115.57,63.5 113.16,63.5 | 115.57,63.5 130.94,63.5 U$11.B20
PWR0
  pour Top: 0,27.94 45.72,27.94 60.96,12.7 71.12,12.7 72.39,13.97 72.39,43.18 72.39,52.07 0,52.07
PWR1
  pour Top: 101.6,45.72 101.6,0 0,0 0,26.67 45.72,26.67 60.96,11.43 72.39,11.43 73.66,12.7 73.66,45.72
PWR2
  pour Top: 0,86.36 149.86,86.36 149.86,0 105.41,0 105.41,44.45 105.41,49.53 105.41,53.34 0,53.34 0,85.09

### Text on the board
tNames: 3.3 / PWM_X0 / PWM_Y0 / PWM_Z0 / DIR_X0 / DIR_Y0 / DIR_Z0 / CS_X0 / CS_Y0 / CS_Z0 / KS | FRONT | FRONT | FRONT | EN / PWM_X1 / PWM_Y1 / PWM_Z1 / DIR_X1 / DIR_Y1 / DIR_Z1 / CS_X1 / CS_Y1 / CS_Z1 / GND / AGND / AGND / . / . / . | Nicholas Kraemer / Kirill Makhachev / 02/2017